# Altium project MB1189.PrjPCB (part 1 of 3)
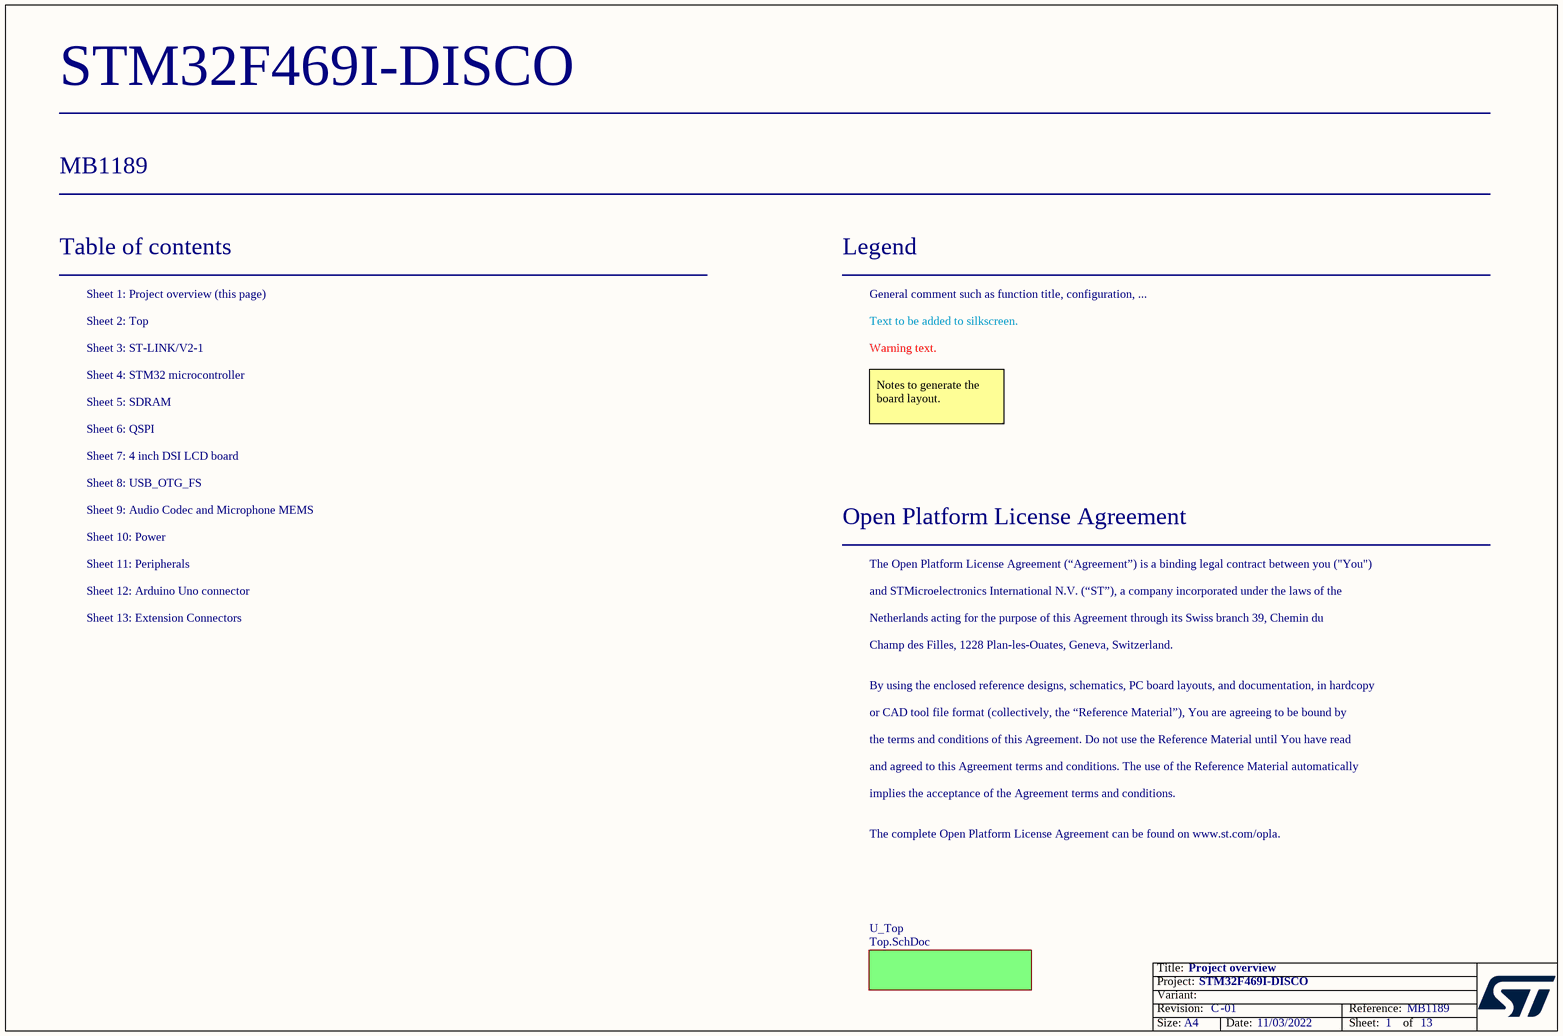
[diagram p0: Project_Overview.SchDoc]
Board_Reference: MB1189; Board_PCB_Revision: C; Board_Name: STM32F469I-DISCO; Board_Document_Date: 11/03/2022; Board_Assembly_revision: 01
13 sheets, 276 parts. Net scope: flat (ports and power ports of the same name join across sheets).
Board file: MB1189.PcbDoc
Sheets:
  Project_Overview.SchDoc
    U_Top = Top.SchDoc
      U_Memory = Memory.SchDoc
      U_Peripherals = Peripherals.SchDoc
      U_Power = Power.SchDoc
      U_ST_LINK_V2-1 = ST_LINK_V2-1.SCHDOC
      U_MCU = MCU.SchDoc
      U_Arduino_ Connectors = Arduino_ Connectors.SchDoc
      U_DSI_LCD = DSI_LCD.SchDoc
      U_QSPI = QSPI.SchDoc
      U_AUDIO2 = AUDIO2.SchDoc
      U_USB_OTG_FS = USB_OTG_FS.SchDoc
      U_ExtensionConnector = ExtensionConnector.SchDoc

## Sheet Project_Overview.SchDoc: Project overview
size A4; Date: Not used; ApprovedBy: Not used; CheckedBy: Not used; Author: Not used; CompanyName: STMicroelectronics; DrawnBy: Not used; Engineer: Not used; Organization: Not used; Address1: Not used; Address2: Not used; Address3: Not used; Address4: Not used; DocumentNumber: MB1189; Revision: Not used; SheetNumber: 1; SheetTotal: 13; CurrentTime: Not used; CurrentDate: Not used; Time: Not used; DocumentFullPathAndName: Not used; DocumentName: Not used; ModifiedDate: Not used; ImagePath: Not used; ProjectName: Not used; Application_BuildNumber: Not used

### Sub-sheets
U_Top = Top.SchDoc: no entries

### Notes on the sheet
- Table of contents
- Sheet 1: Project overview (this page)
- Legend
- General comment such as function title, configuration, ...
- Sheet 2: Top
- Sheet 3: ST-LINK/V2-1
- Sheet 4: STM32 microcontroller
- Text to be added to silkscreen.
- Warning text.
- Sheet 5: SDRAM
- Sheet 6: QSPI
- Notes to generate the board layout.
- Sheet 7: 4 inch DSI LCD board
- Sheet 9: Audio Codec and Microphone MEMS
- Sheet 8: USB_OTG_FS
- Sheet 10: Power
- Sheet 11: Peripherals
- Open Platform License Agreement
- The Open Platform License Agreement (“Agreement”) is a binding legal contract between you ("You")
- Sheet 12: Arduino Uno connector
- Sheet 13: Extension Connectors
- and STMicroelectronics International N.V. (“ST”), a company incorporated under the laws of the
- Netherlands acting for the purpose of this Agreement through its Swiss branch 39, Chemin du
- Champ des Filles, 1228 Plan-les-Ouates, Geneva, Switzerland.
- By using the enclosed reference designs, schematics, PC board layouts, and documentation, in hardcopy
- or CAD tool file format (collectively, the “Reference Material”), You are agreeing to be bound by
- the terms and conditions of this Agreement. Do not use the Reference Material until You have read
- and agreed to this Agreement terms and conditions. The use of the Reference Material automatically
- implies the acceptance of the Agreement terms and conditions.
- The complete Open Platform License Agreement can be found on www.st.com/opla.
- Title:
- Project:
- Size:
- Revision:
- Variant:
- A4
- -
- Date:
- Reference:
- Sheet:
- of

## Sheet Top.SchDoc: MB1189
size A3; Date: 9/24/2014; Author: P.A.; CompanyName: STMicroelectronics; Organization: Microcontrollers Division; Address1: 12, Rue Jules HOROWITZ; Address2: 38019 Grenoble; Address3: FRANCE; DocumentNumber: MB1189; Revision: B-07; SheetNumber: 2; SheetTotal: 13; Project: STM32F469I-DISCO
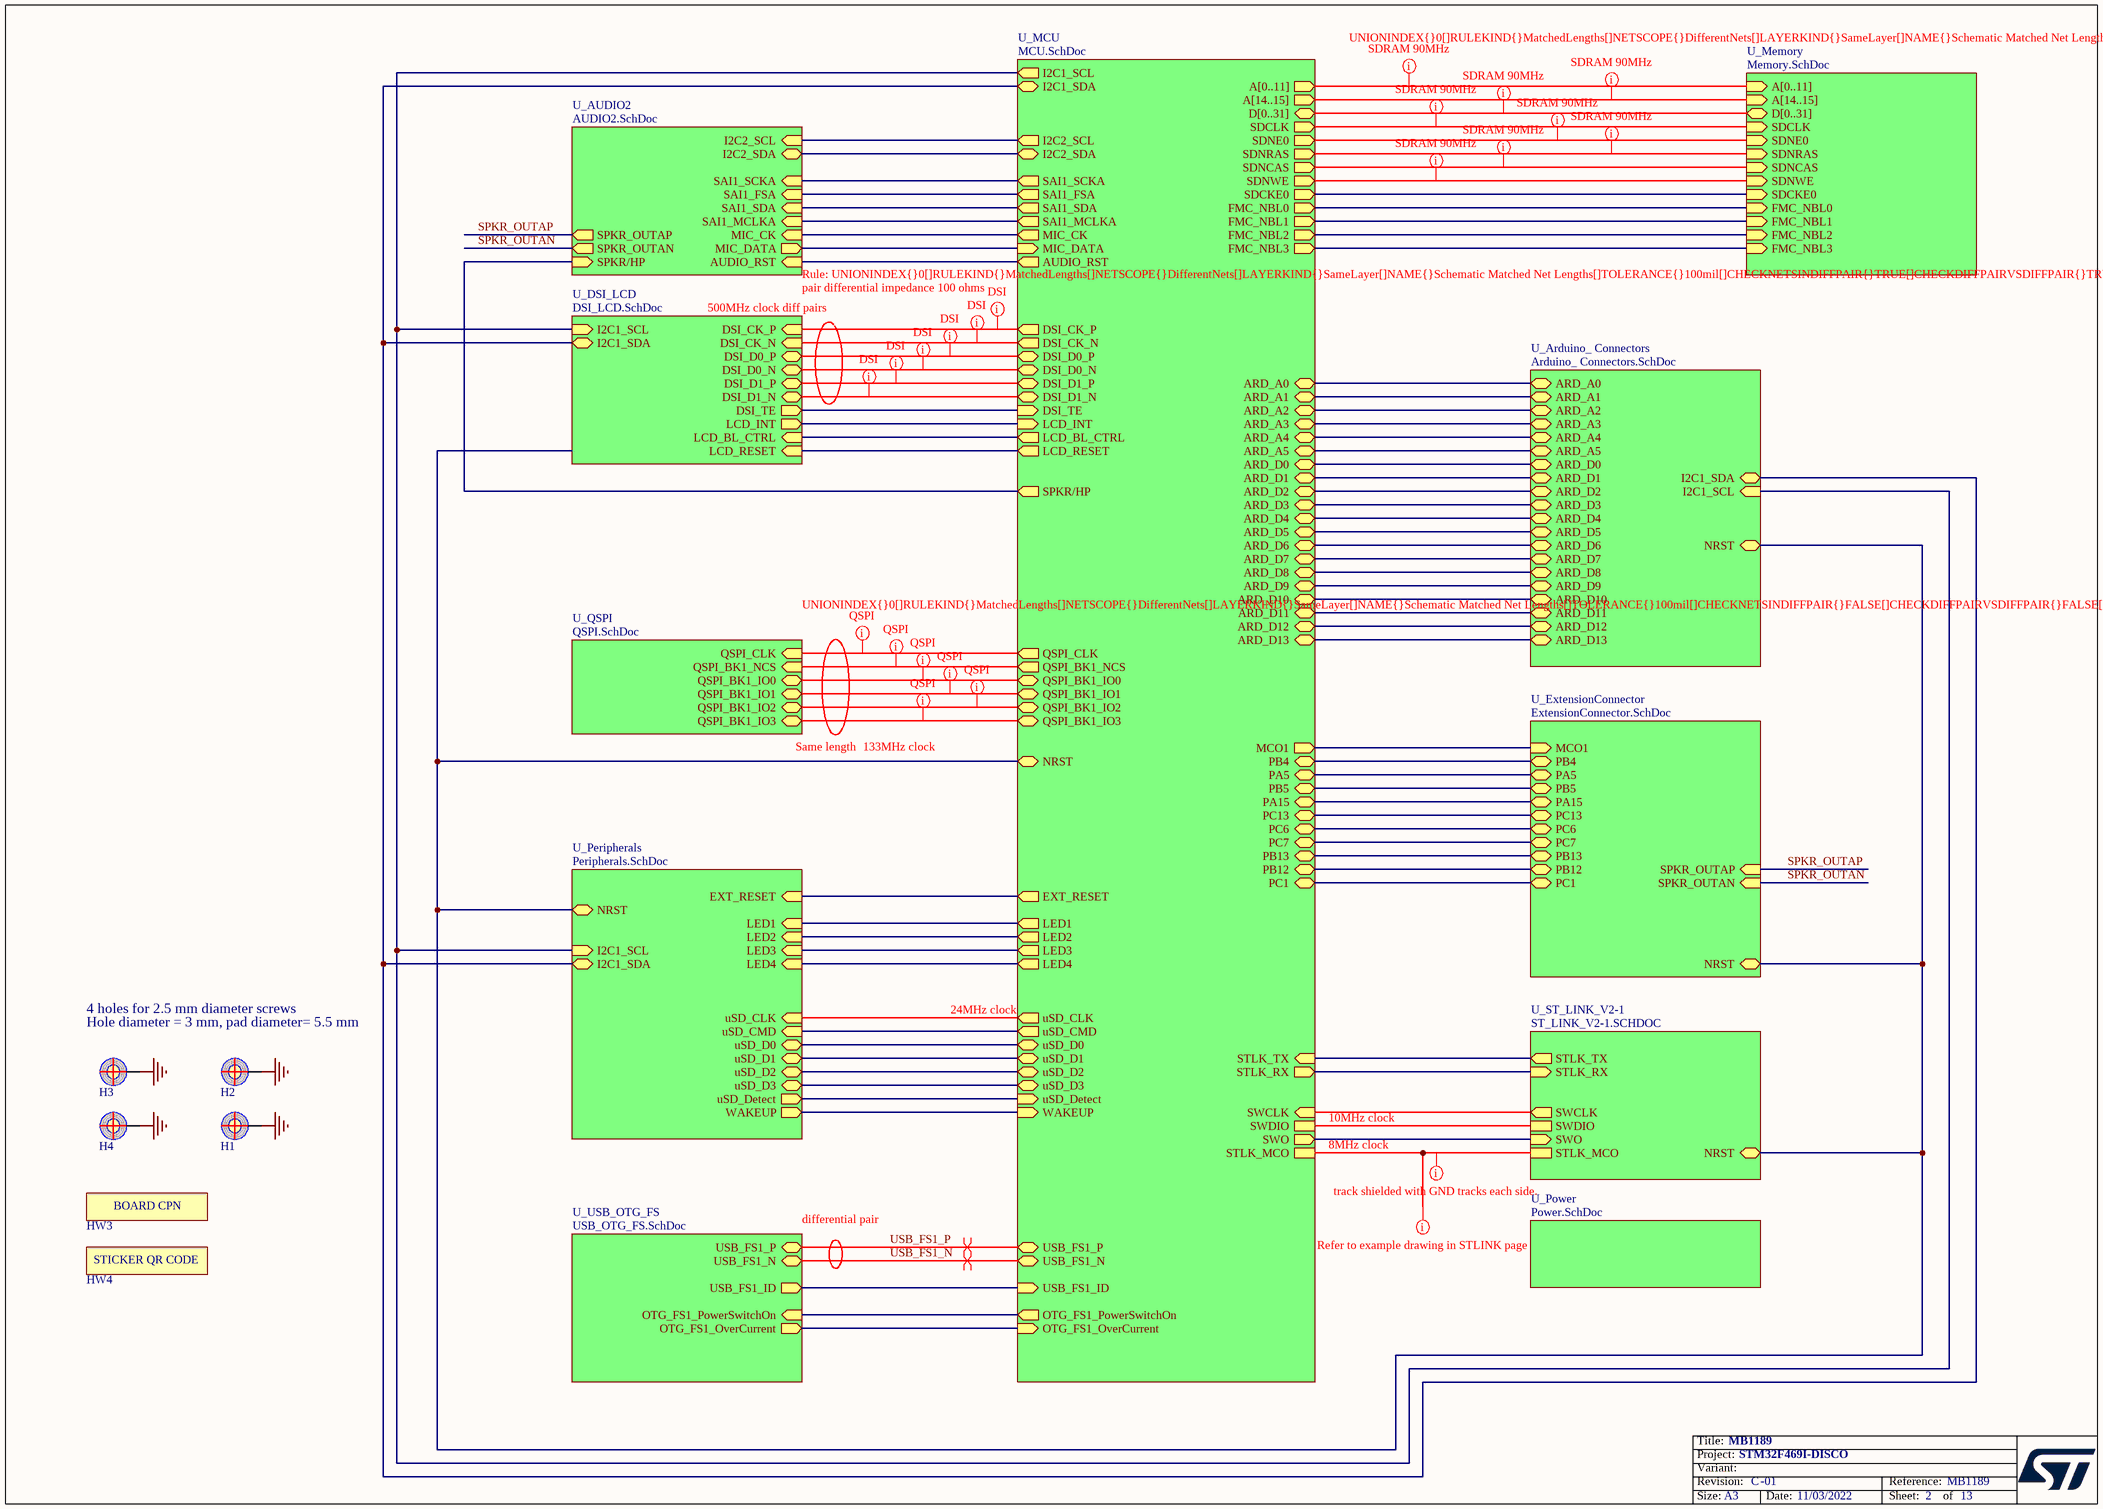
[diagram p1: Top.SchDoc]

### Parts
H1  POSITION HOLE  [HOLE_C5R5D3]  (value not drawn)
H2  POSITION HOLE  [HOLE_C5R5D3]  (value not drawn)
H3  POSITION HOLE  [HOLE_C5R5D3]  (value not drawn)
H4  POSITION HOLE  [HOLE_C5R5D3]  (value not drawn)
HW3  STICKER_BOARD_CPN  [STICKER_BOARD-CPN_13X3]  (value not drawn)  (no BOM)
HW4  STICKER_QR_CODE  [STICKER_QR_CODE_8X8]  (value not drawn)  (no BOM)

### Sub-sheets
U_Arduino_ Connectors = Arduino_ Connectors.SchDoc: I2C1_SDA (bidir), ARD_A0 (bidir), ARD_A1 (bidir), ARD_A2 (bidir), ARD_A3 (bidir), ARD_A4 (bidir), ARD_A5 (bidir), ARD_D5 (bidir), ARD_D4 (bidir), ARD_D3 (bidir), ARD_D2 (bidir), ARD_D1 (bidir), ARD_D0 (bidir), ARD_D13 (bidir), ARD_D12 (bidir), ARD_D11 (bidir), ARD_D10 (bidir), ARD_D9 (bidir), ARD_D8 (bidir), ARD_D6 (bidir), ARD_D7 (bidir), I2C1_SCL (in), NRST (bidir)
U_AUDIO2 = AUDIO2.SchDoc: SAI1_SCKA (in), SAI1_FSA (in), SAI1_SDA (in), AUDIO_RST (in), SAI1_MCLKA (in), I2C2_SCL (in), I2C2_SDA (bidir), MIC_CK (in), MIC_DATA (out), SPKR_OUTAP (out), SPKR_OUTAN (out), SPKR/HP (in)
U_DSI_LCD = DSI_LCD.SchDoc: DSI_CK_P (in), DSI_CK_N (in), DSI_D0_P (bidir), DSI_D0_N (bidir), DSI_D1_P (bidir), DSI_D1_N (bidir), DSI_TE (out), I2C1_SDA (bidir), I2C1_SCL (in), LCD_BL_CTRL (in), LCD_INT (out), LCD_RESET (in)
U_ExtensionConnector = ExtensionConnector.SchDoc: SPKR_OUTAP (in), SPKR_OUTAN (in), NRST (bidir), MCO1 (in), PB4 (bidir), PA5 (bidir), PB5 (bidir), PA15 (bidir), PC13 (bidir), PC7 (bidir), PC6 (bidir), PB13 (bidir), PB12 (bidir), PC1 (bidir)
U_MCU = MCU.SchDoc: LCD_BL_CTRL (out), MIC_CK (out), I2C1_SCL (out), I2C1_SDA (bidir), uSD_D0 (bidir), uSD_D1 (bidir), uSD_D2 (bidir), EXT_RESET (out), uSD_D3 (bidir), uSD_CLK (out), uSD_CMD (out), FMC_NBL3 (out), FMC_NBL2 (out), FMC_NBL0 (out), FMC_NBL1 (out), SAI1_SDA (out), SAI1_SCKA (out), SAI1_FSA (out), SAI1_MCLKA (out), SDNRAS (out), SDCLK (out), SDNCAS (out), SDCKE0 (out), SDNE0 (out), SDNWE (out), D[0..31] (bidir), QSPI_CLK (out), QSPI_BK1_NCS (out), QSPI_BK1_IO3 (bidir), QSPI_BK1_IO2 (bidir), QSPI_BK1_IO1 (bidir), QSPI_BK1_IO0 (bidir), WAKEUP (in), DSI_TE (in), DSI_CK_P (out), DSI_CK_N (out), DSI_D0_P (bidir), DSI_D0_N (bidir), DSI_D1_P (bidir), DSI_D1_N (bidir), NRST (bidir), LCD_INT (in), LED1 (out), LED2 (out), LED3 (out), LED4 (out), uSD_Detect (in), STLK_TX (in), STLK_RX (out), ARD_D5 (bidir), ARD_D4 (bidir), ARD_D3 (bidir), ARD_D2 (bidir), ARD_D1 (bidir), ARD_D0 (bidir), ARD_D13 (bidir), ARD_D12 (bidir), ARD_D11 (bidir), ARD_D10 (bidir), ARD_D9 (bidir), ARD_D8 (bidir), ARD_D6 (bidir), ARD_D7 (bidir), ARD_A0 (bidir), ARD_A1 (bidir), ARD_A2 (bidir), ARD_A3 (bidir), ARD_A4 (bidir), ARD_A5 (bidir), SWCLK (in), SWO (out), AUDIO_RST (out), USB_FS1_ID (in), OTG_FS1_PowerSwitchOn (out), OTG_FS1_OverCurrent (in), I2C2_SCL (out), I2C2_SDA (bidir), MIC_DATA (in), MCO1 (out), USB_FS1_N (bidir), USB_FS1_P (bidir), SWDIO, SPKR/HP (out), A[0..11] (out), A[14..15] (out), PB4 (bidir), PB5 (bidir), PA5 (bidir), PA15 (bidir), PC7 (bidir), PC6 (bidir), PC13 (bidir), PB12 (bidir), PB13 (bidir), PC1 (bidir), LCD_RESET (out), STLK_MCO
U_Memory = Memory.SchDoc: FMC_NBL0 (in), FMC_NBL1 (in), D[0..31] (bidir), SDNCAS (in), SDNWE (in), SDNRAS (in), SDNE0 (in), SDCKE0 (in), SDCLK (in), FMC_NBL3 (in), FMC_NBL2 (in), A[0..11] (in), A[14..15] (in)
U_Peripherals = Peripherals.SchDoc: uSD_CLK (in), uSD_CMD (in), uSD_D0 (bidir), uSD_D1 (bidir), uSD_D2 (bidir), uSD_D3 (bidir), WAKEUP (out), EXT_RESET (in), LED1 (in), LED2 (in), LED3 (in), LED4 (in), NRST (bidir), uSD_Detect (out), I2C1_SDA (bidir), I2C1_SCL (in)
U_Power = Power.SchDoc: no entries
U_QSPI = QSPI.SchDoc: QSPI_BK1_IO0 (bidir), QSPI_BK1_IO2 (bidir), QSPI_BK1_IO1 (bidir), QSPI_CLK (in), QSPI_BK1_NCS (in), QSPI_BK1_IO3 (bidir)
U_ST_LINK_V2-1 = ST_LINK_V2-1.SCHDOC: STLK_RX (in), STLK_TX (out), SWDIO, SWO (in), SWCLK (out), NRST (bidir), STLK_MCO
U_USB_OTG_FS = USB_OTG_FS.SchDoc: OTG_FS1_PowerSwitchOn (in), OTG_FS1_OverCurrent (out), USB_FS1_ID (out), USB_FS1_N (bidir), USB_FS1_P (bidir)

### Nets
GND: H1.1 H2.1 H3.1 H4.1
SPKR_OUTAN: sheet U_AUDIO2/SPKR_OUTAN, sheet U_ExtensionConnector/SPKR_OUTAN
SPKR_OUTAP: sheet U_AUDIO2/SPKR_OUTAP, sheet U_ExtensionConnector/SPKR_OUTAP
USB_FS1_N: sheet U_MCU/USB_FS1_N, sheet U_USB_OTG_FS/USB_FS1_N
USB_FS1_P: sheet U_MCU/USB_FS1_P, sheet U_USB_OTG_FS/USB_FS1_P
(unnamed): sheet U_Memory/FMC_NBL0, sheet U_MCU/FMC_NBL0
(unnamed): sheet U_Memory/FMC_NBL1, sheet U_MCU/FMC_NBL1
(unnamed): sheet U_Memory/SDNCAS, sheet U_MCU/SDNCAS
(unnamed): sheet U_Memory/SDNWE, sheet U_MCU/SDNWE
(unnamed): sheet U_Memory/SDNRAS, sheet U_MCU/SDNRAS
(unnamed): sheet U_Memory/SDNE0, sheet U_MCU/SDNE0
(unnamed): sheet U_Memory/SDCKE0, sheet U_MCU/SDCKE0
(unnamed): sheet U_Memory/SDCLK, sheet U_MCU/SDCLK
(unnamed): sheet U_Memory/FMC_NBL3, sheet U_MCU/FMC_NBL3
(unnamed): sheet U_Memory/FMC_NBL2, sheet U_MCU/FMC_NBL2
(unnamed): sheet U_Peripherals/uSD_CLK, sheet U_MCU/uSD_CLK
(unnamed): sheet U_Peripherals/uSD_CMD, sheet U_MCU/uSD_CMD
(unnamed): sheet U_Peripherals/uSD_D0, sheet U_MCU/uSD_D0
(unnamed): sheet U_Peripherals/uSD_D1, sheet U_MCU/uSD_D1
(unnamed): sheet U_Peripherals/uSD_D2, sheet U_MCU/uSD_D2
(unnamed): sheet U_Peripherals/uSD_D3, sheet U_MCU/uSD_D3
(unnamed): sheet U_Peripherals/WAKEUP, sheet U_MCU/WAKEUP
(unnamed): sheet U_Peripherals/EXT_RESET, sheet U_MCU/EXT_RESET
(unnamed): sheet U_Peripherals/LED1, sheet U_MCU/LED1
(unnamed): sheet U_Peripherals/LED2, sheet U_MCU/LED2
(unnamed): sheet U_Peripherals/LED3, sheet U_MCU/LED3
(unnamed): sheet U_Peripherals/LED4, sheet U_MCU/LED4
(unnamed): sheet U_Peripherals/NRST, sheet U_ST_LINK_V2-1/NRST, sheet U_MCU/NRST, sheet U_Arduino_ Connectors/NRST, sheet U_ExtensionConnector/NRST
(unnamed): sheet U_Peripherals/uSD_Detect, sheet U_MCU/uSD_Detect
(unnamed): sheet U_Peripherals/I2C1_SDA, sheet U_MCU/I2C1_SDA, sheet U_Arduino_ Connectors/I2C1_SDA, sheet U_DSI_LCD/I2C1_SDA
(unnamed): sheet U_Peripherals/I2C1_SCL, sheet U_MCU/I2C1_SCL, sheet U_Arduino_ Connectors/I2C1_SCL, sheet U_DSI_LCD/I2C1_SCL
(unnamed): sheet U_ST_LINK_V2-1/STLK_RX, sheet U_MCU/STLK_RX
(unnamed): sheet U_ST_LINK_V2-1/STLK_TX, sheet U_MCU/STLK_TX
(unnamed): sheet U_ST_LINK_V2-1/SWDIO, sheet U_MCU/SWDIO
(unnamed): sheet U_ST_LINK_V2-1/SWO, sheet U_MCU/SWO
(unnamed): sheet U_ST_LINK_V2-1/SWCLK, sheet U_MCU/SWCLK
(unnamed): sheet U_ST_LINK_V2-1/STLK_MCO, sheet U_MCU/STLK_MCO
(unnamed): sheet U_MCU/LCD_BL_CTRL, sheet U_DSI_LCD/LCD_BL_CTRL
(unnamed): sheet U_MCU/MIC_CK, sheet U_AUDIO2/MIC_CK
(unnamed): sheet U_MCU/SAI1_SDA, sheet U_AUDIO2/SAI1_SDA
(unnamed): sheet U_MCU/SAI1_SCKA, sheet U_AUDIO2/SAI1_SCKA
(unnamed): sheet U_MCU/SAI1_FSA, sheet U_AUDIO2/SAI1_FSA
(unnamed): sheet U_MCU/SAI1_MCLKA, sheet U_AUDIO2/SAI1_MCLKA
(unnamed): sheet U_MCU/QSPI_CLK, sheet U_QSPI/QSPI_CLK
(unnamed): sheet U_MCU/QSPI_BK1_NCS, sheet U_QSPI/QSPI_BK1_NCS
(unnamed): sheet U_MCU/QSPI_BK1_IO3, sheet U_QSPI/QSPI_BK1_IO3
(unnamed): sheet U_MCU/QSPI_BK1_IO2, sheet U_QSPI/QSPI_BK1_IO2
(unnamed): sheet U_MCU/QSPI_BK1_IO1, sheet U_QSPI/QSPI_BK1_IO1
(unnamed): sheet U_MCU/QSPI_BK1_IO0, sheet U_QSPI/QSPI_BK1_IO0
(unnamed): sheet U_MCU/DSI_TE, sheet U_DSI_LCD/DSI_TE
(unnamed): sheet U_MCU/DSI_CK_P, sheet U_DSI_LCD/DSI_CK_P
(unnamed): sheet U_MCU/DSI_CK_N, sheet U_DSI_LCD/DSI_CK_N
(unnamed): sheet U_MCU/DSI_D0_P, sheet U_DSI_LCD/DSI_D0_P
(unnamed): sheet U_MCU/DSI_D0_N, sheet U_DSI_LCD/DSI_D0_N
(unnamed): sheet U_MCU/DSI_D1_P, sheet U_DSI_LCD/DSI_D1_P
(unnamed): sheet U_MCU/DSI_D1_N, sheet U_DSI_LCD/DSI_D1_N
(unnamed): sheet U_MCU/LCD_INT, sheet U_DSI_LCD/LCD_INT
(unnamed): sheet U_MCU/ARD_D5, sheet U_Arduino_ Connectors/ARD_D5
(unnamed): sheet U_MCU/ARD_D4, sheet U_Arduino_ Connectors/ARD_D4
(unnamed): sheet U_MCU/ARD_D3, sheet U_Arduino_ Connectors/ARD_D3
(unnamed): sheet U_MCU/ARD_D2, sheet U_Arduino_ Connectors/ARD_D2
(unnamed): sheet U_MCU/ARD_D1, sheet U_Arduino_ Connectors/ARD_D1
(unnamed): sheet U_MCU/ARD_D0, sheet U_Arduino_ Connectors/ARD_D0
(unnamed): sheet U_MCU/ARD_D13, sheet U_Arduino_ Connectors/ARD_D13
(unnamed): sheet U_MCU/ARD_D12, sheet U_Arduino_ Connectors/ARD_D12
(unnamed): sheet U_MCU/ARD_D11, sheet U_Arduino_ Connectors/ARD_D11
(unnamed): sheet U_MCU/ARD_D10, sheet U_Arduino_ Connectors/ARD_D10
(unnamed): sheet U_MCU/ARD_D9, sheet U_Arduino_ Connectors/ARD_D9
(unnamed): sheet U_MCU/ARD_D8, sheet U_Arduino_ Connectors/ARD_D8
(unnamed): sheet U_MCU/ARD_D6, sheet U_Arduino_ Connectors/ARD_D6
(unnamed): sheet U_MCU/ARD_D7, sheet U_Arduino_ Connectors/ARD_D7
(unnamed): sheet U_MCU/ARD_A0, sheet U_Arduino_ Connectors/ARD_A0
(unnamed): sheet U_MCU/ARD_A1, sheet U_Arduino_ Connectors/ARD_A1
(unnamed): sheet U_MCU/ARD_A2, sheet U_Arduino_ Connectors/ARD_A2
(unnamed): sheet U_MCU/ARD_A3, sheet U_Arduino_ Connectors/ARD_A3
(unnamed): sheet U_MCU/ARD_A4, sheet U_Arduino_ Connectors/ARD_A4
(unnamed): sheet U_MCU/ARD_A5, sheet U_Arduino_ Connectors/ARD_A5
(unnamed): sheet U_MCU/AUDIO_RST, sheet U_AUDIO2/AUDIO_RST
(unnamed): sheet U_MCU/USB_FS1_ID, sheet U_USB_OTG_FS/USB_FS1_ID
(unnamed): sheet U_MCU/OTG_FS1_PowerSwitchOn, sheet U_USB_OTG_FS/OTG_FS1_PowerSwitchOn
(unnamed): sheet U_MCU/OTG_FS1_OverCurrent, sheet U_USB_OTG_FS/OTG_FS1_OverCurrent
(unnamed): sheet U_MCU/I2C2_SCL, sheet U_AUDIO2/I2C2_SCL
(unnamed): sheet U_MCU/I2C2_SDA, sheet U_AUDIO2/I2C2_SDA
(unnamed): sheet U_MCU/MIC_DATA, sheet U_AUDIO2/MIC_DATA
(unnamed): sheet U_MCU/MCO1, sheet U_ExtensionConnector/MCO1
(unnamed): sheet U_MCU/SPKR/HP, sheet U_AUDIO2/SPKR/HP
(unnamed): sheet U_MCU/PB4, sheet U_ExtensionConnector/PB4
(unnamed): sheet U_MCU/PB5, sheet U_ExtensionConnector/PB5
(unnamed): sheet U_MCU/PA5, sheet U_ExtensionConnector/PA5
(unnamed): sheet U_MCU/PA15, sheet U_ExtensionConnector/PA15
(unnamed): sheet U_MCU/PC7, sheet U_ExtensionConnector/PC7
(unnamed): sheet U_MCU/PC6, sheet U_ExtensionConnector/PC6
(unnamed): sheet U_MCU/PC13, sheet U_ExtensionConnector/PC13
(unnamed): sheet U_MCU/PB12, sheet U_ExtensionConnector/PB12
(unnamed): sheet U_MCU/PB13, sheet U_ExtensionConnector/PB13
(unnamed): sheet U_MCU/PC1, sheet U_ExtensionConnector/PC1
(unnamed): sheet U_MCU/LCD_RESET, sheet U_DSI_LCD/LCD_RESET

### Buses and harness runs
bus sheet U_MCU/A[0..11] = sheet U_Memory/A[0..11]
bus sheet U_MCU/A[14..15] = sheet U_Memory/A[14..15]
bus sheet U_MCU/D[0..31] = sheet U_Memory/D[0..31]

### Layout directives
rule Matched Net Lengths [Tolerance = 250mil]: (no net found under the mark)
rule Matched Net Lengths [Tolerance = 100mil]; rule ? : (no net found under the mark)
rule Matched Net Lengths [Tolerance = 100mil]: (no net found under the mark)
differential pair: USB_FS1_N, USB_FS1_P
mark named track shielded with GND tracks each side.: (no net found under the mark)
mark named Refer to example drawing in STLINK page: (no net found under the mark)

### Notes on the sheet
- 500MHz clock diff pairs
- Same length
- 133MHz clock
- 4 holes for 2.5 mm diameter screws
- Hole diameter = 3 mm, pad diameter= 5.5 mm
- 24MHz clock
- 10MHz clock
- 8MHz clock
- differential pair
- Title:
- Project:
- Size:
- Revision:
- Variant:
- A3
- -
- Date:
- Reference:
- Sheet:
- of
- (in symbol STICKER_BOARD_CPN) BOARD CPN
- (in symbol STICKER_QR_CODE) STICKER QR CODE

### Library data of the parts
H1-H4 = POSITION HOLE: Ordered by: Subcon

## Sheet Memory.SchDoc: SDRAM
size A4; Date: 9/24/2014; Author: P.A.; CompanyName: STMicroelectronics; Organization: Microcontrollers Division; Address1: 12, Rue Jules HOROWITZ; Address2: 38019 Grenoble; Address3: FRANCE; DocumentNumber: MB1189; Revision: B-07; SheetNumber: 5; SheetTotal: 13; Project: STM32F469I-DISCO
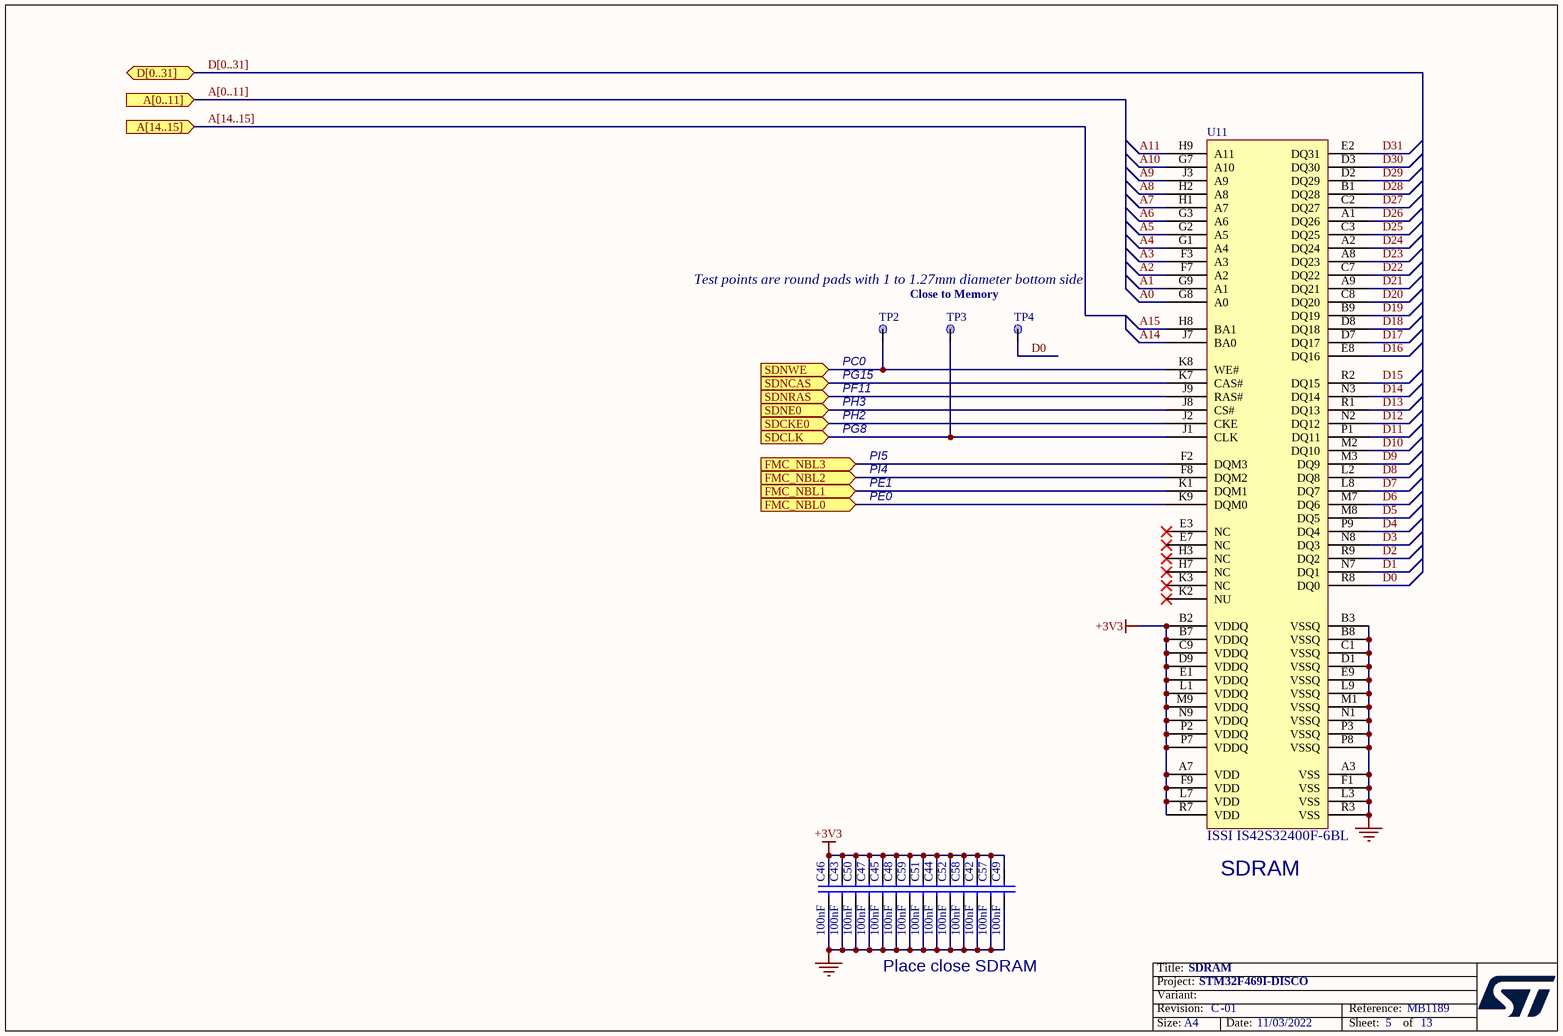
[diagram p2: Memory.SchDoc]

### Parts
C42  100nF  [0402C]
C43  100nF  [0402C]
C44  100nF  [0402C]
C45  100nF  [0402C]
C46  100nF  [0402C]
C47  100nF  [0402C]
C48  100nF  [0402C]
C49  100nF  [0402C]
C50  100nF  [0402C]
C51  100nF  [0402C]
C52  100nF  [0402C]
C57  100nF  [0402C]
C58  100nF  [0402C]
C59  100nF  [0402C]
TP2  TP  [TP_C40]  (value not drawn)
TP3  TP  [TP_C40]  (value not drawn)
TP4  TP  [TP_C40]  (value not drawn)
U11  ISSI IS42S32400F-6BL  [ICC_VFBGA90_8X13_P080]

### Ports
A[0..11] (in), A[14..15] (in), D[0..31] (bidir), FMC_NBL0 (in), FMC_NBL1 (in), FMC_NBL2 (in), FMC_NBL3 (in), SDCKE0 (in), SDCLK (in), SDNCAS (in), SDNE0 (in), SDNRAS (in), SDNWE (in)

### Nets
+3V3: C42.1 C43.1 C44.1 C45.1 C46.1 C47.1 C48.1 C49.1 C50.1 C51.1 C52.1 C57.1 C58.1 C59.1 U11.A7(VDD) U11.B2(VDDQ) U11.B7(VDDQ) U11.C9(VDDQ) U11.D9(VDDQ) U11.E1(VDDQ) U11.F9(VDD) U11.L1(VDDQ) U11.L7(VDD) U11.M9(VDDQ) U11.N9(VDDQ) U11.P2(VDDQ) U11.P7(VDDQ) U11.R7(VDD)
GND: C42.2 C43.2 C44.2 C45.2 C46.2 C47.2 C48.2 C49.2 C50.2 C51.2 C52.2 C57.2 C58.2 C59.2 U11.A3(VSS) U11.B3(VSSQ) U11.B8(VSSQ) U11.C1(VSSQ) U11.D1(VSSQ) U11.E9(VSSQ) U11.F1(VSS) U11.L3(VSS) U11.L9(VSSQ) U11.M1(VSSQ) U11.N1(VSSQ) U11.P3(VSSQ) U11.P8(VSSQ) U11.R3(VSS)
A0: U11.G8(A0)
A1: U11.G9(A1)
A2: U11.F7(A2)
A3: U11.F3(A3)
A4: U11.G1(A4)
A5: U11.G2(A5)
A6: U11.G3(A6)
A7: U11.H1(A7)
A8: U11.H2(A8)
A9: U11.J3(A9)
A10: U11.G7(A10)
A11: U11.H9(A11)
A14: U11.J7(BA0)
A15: U11.H8(BA1)
D0: TP4.1 U11.R8(DQ0)
D1: U11.N7(DQ1)
D2: U11.R9(DQ2)
D3: U11.N8(DQ3)
D4: U11.P9(DQ4)
D5: U11.M8(DQ5)
D6: U11.M7(DQ6)
D7: U11.L8(DQ7)
D8: U11.L2(DQ8)
D9: U11.M3(DQ9)
D10: U11.M2(DQ10)
D11: U11.P1(DQ11)
D12: U11.N2(DQ12)
D13: U11.R1(DQ13)
D14: U11.N3(DQ14)
D15: U11.R2(DQ15)
D16: U11.E8(DQ16)
D17: U11.D7(DQ17)
D18: U11.D8(DQ18)
D19: U11.B9(DQ19)
D20: U11.C8(DQ20)
D21: U11.A9(DQ21)
D22: U11.C7(DQ22)
D23: U11.A8(DQ23)
D24: U11.A2(DQ24)
D25: U11.C3(DQ25)
D26: U11.A1(DQ26)
D27: U11.C2(DQ27)
D28: U11.B1(DQ28)
D29: U11.D2(DQ29)
D30: U11.D3(DQ30)
D31: U11.E2(DQ31)
PC0: TP2.1 U11.K8(WE#) ; port SDNWE
PE0: U11.K9(DQM0) ; port FMC_NBL0
PE1: U11.K1(DQM1) ; port FMC_NBL1
PF11: U11.J9(RAS#) ; port SDNRAS
PG8: TP3.1 U11.J1(CLK) ; port SDCLK
PG15: U11.K7(CAS#) ; port SDNCAS
PH2: U11.J2(CKE) ; port SDCKE0
PH3: U11.J8(CS#) ; port SDNE0
PI4: U11.F8(DQM2) ; port FMC_NBL2
PI5: U11.F2(DQM3) ; port FMC_NBL3

Not connected (* = marked no-connect by the designer): U11 E3(NC)* E7(NC)* H3(NC)* H7(NC)* K2(NU)* K3(NC)*

### Buses and harness runs
bus A[0..11] = port A[0..11]
bus A[14..15] = port A[14..15]
bus D[0..31] = port D[0..31]

### Notes on the sheet
- Test points are round pads with 1 to 1.27mm diameter bottom side
- Close to Memory
- (near TP2) PC0
- (near TP2) PG15
- PF11
- PH3
- PH2
- PG8
- PE1
- PE0
- PI5
- PI4
- (near U11) SDRAM
- Place close SDRAM
- Title:
- Project:
- Size:
- Revision:
- Variant:
- A4
- -
- Date:
- Reference:
- Sheet:
- of

### Library data of the parts
C42-C52 C57-C59 = Cap: Capacitor; Manuf_part_1: CC0402KRX7R7BB104; Manuf_1: YAGEO; Ordered by: Subcon; Published: 8-Jun-2000; Revision: July-2002: Re-released for DXP Platform.; Publisher: Altium Limited; Value: 100nF
TP2-TP4 = TP: Ordered by: Subcon
U11 = IS42S32400F-6BL: SDRAM 128MBit 166MHZ 90BGA; Ordered by: Subcon; ECCN_US/EU: EAR99/NEC; Manuf_1: ISSI; Manuf_Part_1: IS42S32400F-6BL; Value: IS42S32400F-6BL

## Sheet Peripherals.SchDoc: Peripherals
size A4; Date: 9/24/2014; Author: P.A.; CompanyName: STMicroelectronics; Organization: Microcontrollers Division; Address1: 12, Rue Jules HOROWITZ; Address2: 38019 Grenoble; Address3: FRANCE; DocumentNumber: MB1189; Revision: B-07; SheetNumber: 11; SheetTotal: 13; Project: STM32F469I-DISCO
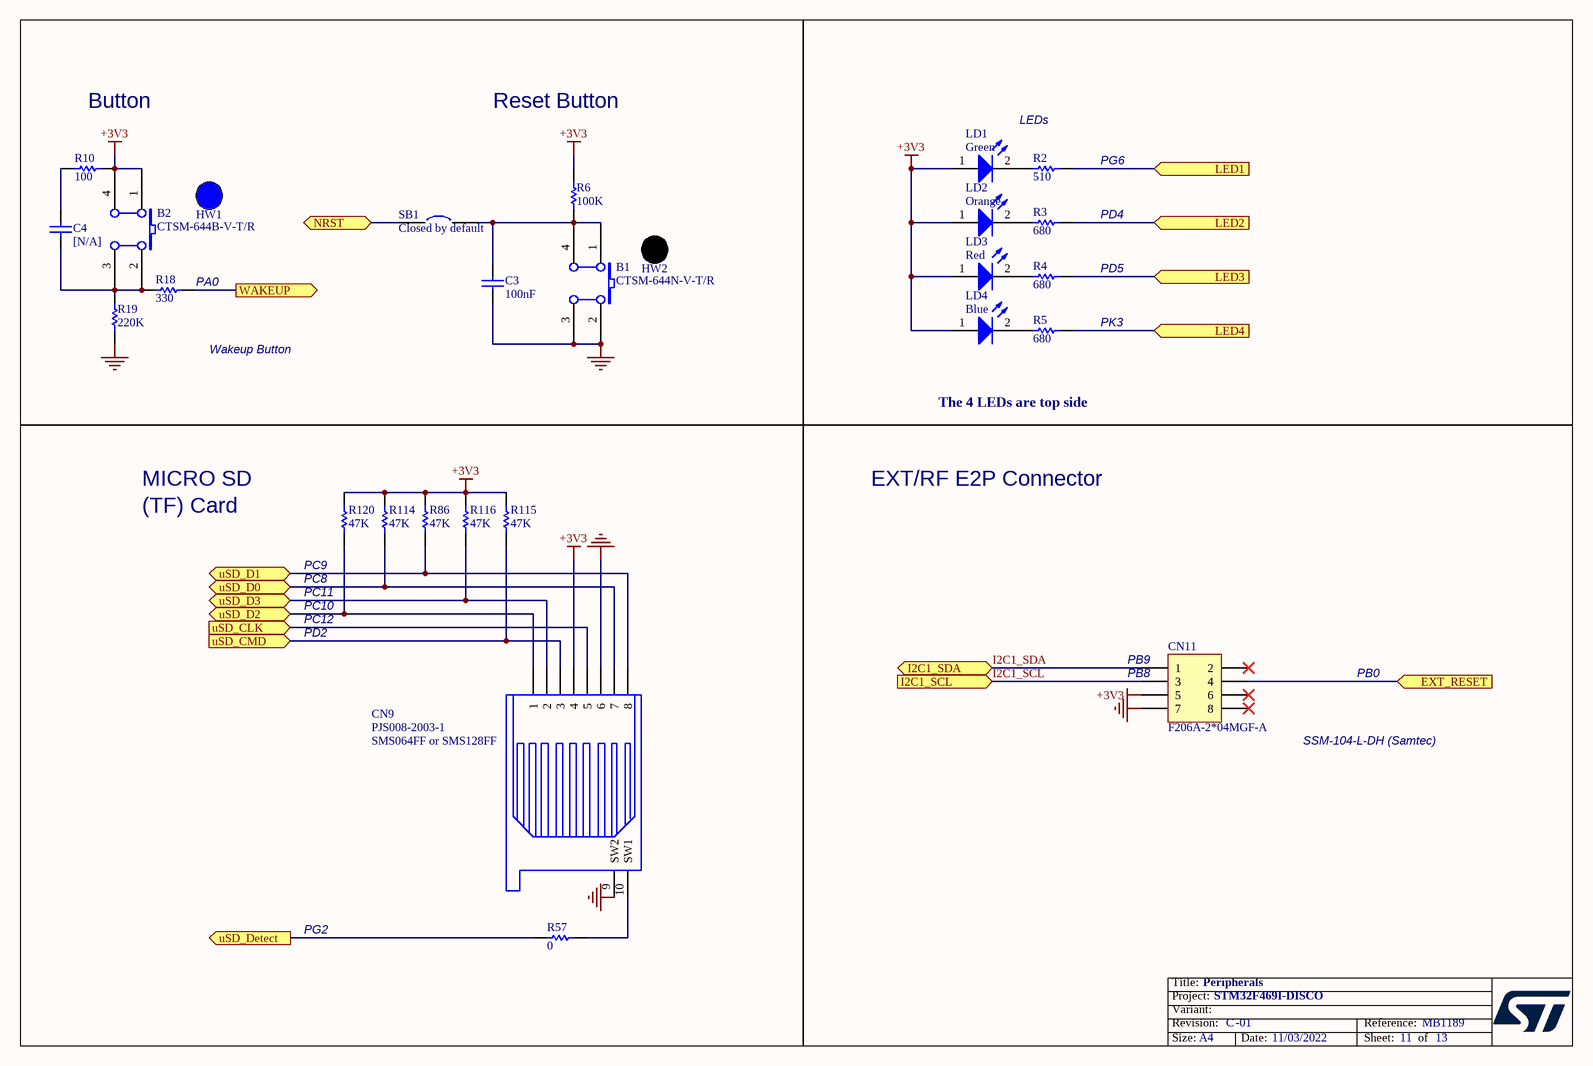
[diagram p3: Peripherals.SchDoc]

### Parts
B1  CTSM-644N-V-T/R  [PB10]
B2  CTSM-644B-V-T/R  [PB10]
C3  100nF  [0402C]
C4  [N/A]  [0603C]
CN9  PJS008-2003-1  [MSD_PJS008_]
CN11  F206A-2*04MGF-A  [SSM-104-L-DH]
HW1  BUTTON_HAT_BLUE  (value not drawn)  (mechanical)
HW2  BUTTON_HAT_BLACK  (value not drawn)  (mechanical)
LD1  Green  [0603D]
LD2  Orange  [0603D]
LD3  Red  [0603D]
LD4  Blue  [0603D]
R2  510  [0603R]
R3  680  [0603R]
R4  680  [0603R]
R5  680  [0603R]
R6  100K  [0603R]
R10  100  [0603R]
R18  330  [0603R]
R19  220K  [0603R]
R57  0  [0603R]
R86  47K  [0603R]
R114  47K  [0603R]
R115  47K  [0603R]
R116  47K  [0603R]
R120  47K  [0603R]
SB1  Closed by default  [SB_0603]

### Ports
EXT_RESET (in), I2C1_SCL (in), I2C1_SDA (bidir), LED1 (in), LED2 (in), LED3 (in), LED4 (in), NRST (bidir), uSD_CLK (in), uSD_CMD (in), uSD_D0 (bidir), uSD_D1 (bidir), uSD_D2 (bidir), uSD_D3 (bidir), uSD_Detect (out), WAKEUP (out)

### Nets
+3V3: B2.1(A0) B2.4(A1) CN9.4 CN11.5 LD1.1(A) LD2.1(A) LD3.1(A) LD4.1(A) R6.1 R10.1 R86.1 R114.1 R115.1 R116.1 R120.1
GND: B1.2(B0) B1.3(B1) C3.1 CN9.6 CN9.9(SW2) CN11.7 R19.2
I2C1_SCL: CN11.3 ; port I2C1_SCL
I2C1_SDA: CN11.1 ; port I2C1_SDA
NRST: SB1.1 ; port NRST
PA0: R18.2 ; port WAKEUP
PB0: CN11.4 ; port EXT_RESET
PC8: CN9.7 R114.2 ; port uSD_D0
PC10: CN9.1 R120.2 ; port uSD_D2
PC11: CN9.2 R116.2 ; port uSD_D3
PC12: CN9.5 ; port uSD_CLK
PD2: CN9.3 R115.2 ; port uSD_CMD
PD4: R3.1 ; port LED2
PD5: R4.1 ; port LED3
PG2: R57.1 ; port uSD_Detect
PG6: R2.1 ; port LED1
PK3: R5.1 ; port LED4
uSD_D1: CN9.8 R86.2 ; port uSD_D1
NetB1_1: B1.1(A0) B1.4(A1) C3.2 R6.2 SB1.2
NetB2_2: B2.2(B0) B2.3(B1) C4.2 R18.1 R19.1
NetC4_1: C4.1 R10.2
NetCN9_10: CN9.10(SW1) R57.2
NetLD1_2: LD1.2(K) R2.2
NetLD2_2: LD2.2(K) R3.2
NetLD3_2: LD3.2(K) R4.2
NetLD4_2: LD4.2(K) R5.2

Not connected (* = marked no-connect by the designer): CN11 2* 6* 8*

### Notes on the sheet
- Button
- Reset Button
- LEDs
- (near R2) PG6
- PD4
- (near R18) PA0
- PD5
- PK3
- Wakeup Button
- The 4 LEDs are top side
- MICRO SD
- (TF) Card
- EXT/RF E2P Connector
- (near R120) PC8
- (near R120) PC9
- PC11
- PC10
- PC12
- PD2
- (near CN11) PB9
- (near CN11) PB8
- PB0
- (near CN9) SMS064FF or SMS128FF
- (near CN11) SSM-104-L-DH (Samtec)
- PG2
- Title:
- Project:
- Size:
- Revision:
- Variant:
- A4
- -
- Date:
- Reference:
- Sheet:
- of

### Library data of the parts
B1 = SW PUSHBUTTON: Push-Button BLACK; Manuf_1: CHAU HUA; Ordered by: Subcon; Assembly: with Blue cap; Silkscreen: USER; Manuf_part_1: CTSM-644N-V-T/R; Value: CTSM-644N-V-T/R
B2 = SW PUSHBUTTON: Push-Button BLUE; Manuf_1: CHAU HUA; Ordered by: Subcon; Assembly: with Blue cap; Silkscreen: USER; Manuf_part_1: CTSM-644B-V-T/R; Value: CTSM-644B-V-T/R
C3 = CAP: Capacitor; Manuf_part_1: CC0402KRX7R7BB104; Manuf_1: YAGEO; Ordered by: Subcon; Published: 8-Jun-2000; Revision: July-2002: Re-released for DXP Platform.; Publisher: Altium Limited; Value: 100NF
C4 = CAP: Capacitor; Value: 100pF; Ordered by: Subcon; Fitted: NO; Published: 8-Jun-2000; Revision: July-2002: Re-released for DXP Platform.; Publisher: Altium Limited
CN9 = SMS016AFA5E: MicroSD Card Conn, Reversed-Type, Mnt Push-Push, Positionning holes; Manuf_1: Yamaichi; Ordered by: Subcon; Silkscreen: uSD; Manuf_Part_1: PJS008-2003-1
CN11 = SSM-104-L-DH: Header, 4-Pin, Dual row; Manuf_1: SAMTEC; Ordered by: Subcon; Silkscreen: RFEEPROM; Revision: 17-Jul-2002: Re-released for DXP Platform.; Publisher: Altium Limited; Manuf_Part_1: SSM-104-L-DH
HW1 = BUTTON_HAT_BLUE: switch hat,blue; Manuf_part_1: KTSC-62B; Manuf_1: CHAU HUA
HW2 = BUTTON_HAT_BLACK: switch hat,black; Manuf_part_1: KTSC-62K; Manuf_1: CHAU HUA
LD1 = LED2: Typical RED, GREEN, YELLOW, AMBER GaAs LED; Manuf_1: Everlight Electronics; Manuf_part_1: 19-217/G7C-AN1P2/3T; Ordered by: Subcon; ECCN_US/EU: EAR99/NEC; Published: 8-Jun-2000; Revision: July-2002: Re-released for DXP Platform.; Publisher: Altium Limited
LD2 = LED2: Typical RED, GREEN, YELLOW, AMBER GaAs LED; Manuf_1: Everlight Electronics; Manuf_part_1: 19-217/S2C-AM2N2VY/3T; Ordered by: Subcon; ECCN_US/EU: EAR99/NEC; Published: 8-Jun-2000; Revision: July-2002: Re-released for DXP Platform.; Publisher: Altium Limited
LD3 = LED2: Typical RED, GREEN, YELLOW, AMBER GaAs LED; Manuf_1: Everlight Electronics; Manuf_part_1: 19-217/R6C-AL1M2VY/3T; Ordered by: Subcon; ECCN_US/EU: EAR99/NEC; Published: 8-Jun-2000; Revision: July-2002: Re-released for DXP Platform.; Publisher: Altium Limited
LD4 = LED2: Typical RED, GREEN, YELLOW, AMBER GaAs LED; Manuf_1: Everlight Electronics; Manuf_part_1: 19-217/BHC-ZL1M2RY/3T; Ordered by: Subcon; ECCN_US/EU: EAR99/NEC; Published: 8-Jun-2000; Revision: July-2002: Re-released for DXP Platform.; Publisher: Altium Limited
R2 = Res1: Resistor; Manuf_1: YAGEO; Manuf_part_1: RC0603FR-07510RL; Ordered by: Subcon; Published: 8-Jun-2000; Revision: July-2002: Re-released for DXP Platform.; Publisher: Altium Limited; Value: 510
R3-R5 = Res1: Resistor; Manuf_1: YAGEO; Manuf_part_1: RC0603FR-07680RL; Ordered by: Subcon; Published: 8-Jun-2000; Revision: July-2002: Re-released for DXP Platform.; Publisher: Altium Limited; Value: 680
R6 = res1: Resistor; Manuf_1: YAGEO; Manuf_part_1: RC0603FR-07100KL; Ordered by: Subcon; Published: 8-Jun-2000; Revision: July-2002: Re-released for DXP Platform.; Publisher: Altium Limited; Value: 100K
R10 = Res1: Resistor; Manuf_1: YAGEO; Manuf_part_1: RC0603FR-07100RL; Ordered by: Subcon; Published: 8-Jun-2000; Revision: July-2002: Re-released for DXP Platform.; Publisher: Altium Limited; Value: 100
R18 = Res1: Resistor; Manuf_1: YAGEO; Manuf_part_1: RC0603FR-07330RL; Ordered by: Subcon; Published: 8-Jun-2000; Revision: July-2002: Re-released for DXP Platform.; Publisher: Altium Limited; Value: 330
R19 = res1: Resistor; Manuf_1: YAGEO; Manuf_part_1: RC0603FR-07220KL; Ordered by: Subcon; Published: 8-Jun-2000; Revision: July-2002: Re-released for DXP Platform.; Publisher: Altium Limited; Value: 220k
R57 = Res1: Resistor; Manuf_1: YAGEO; Manuf_part_1: RC0603JR-070RL; Ordered by: Subcon; Published: 8-Jun-2000; Revision: July-2002: Re-released for DXP Platform.; Publisher: Altium Limited; Value: 0
R86 R114-R116 R120 = res1: Resistor; Manuf_1: YAGEO; Manuf_part_1: RC0603FR-0747KL; Ordered by: Subcon; Published: 8-Jun-2000; Revision: July-2002: Re-released for DXP Platform.; Publisher: Altium Limited; Value: 47K
SB1 = Circuit Breaker: Ordered by: Subcon; Comments: Solder bridge; Published: 24-Mar-1999; Revision: July-2002: Re-released for DXP Platform.; Publisher: Altium Limited

## Sheet Power.SchDoc: Power
size A4; Date: 9/24/2014; Author: P.A.; CompanyName: STMicroelectronics; Organization: Microcontrollers Division; Address1: 12, Rue Jules HOROWITZ; Address2: 38019 Grenoble; Address3: FRANCE; DocumentNumber: MB1189; Revision: B-07; SheetNumber: 10; SheetTotal: 13; Project: STM32F469I-DISCO
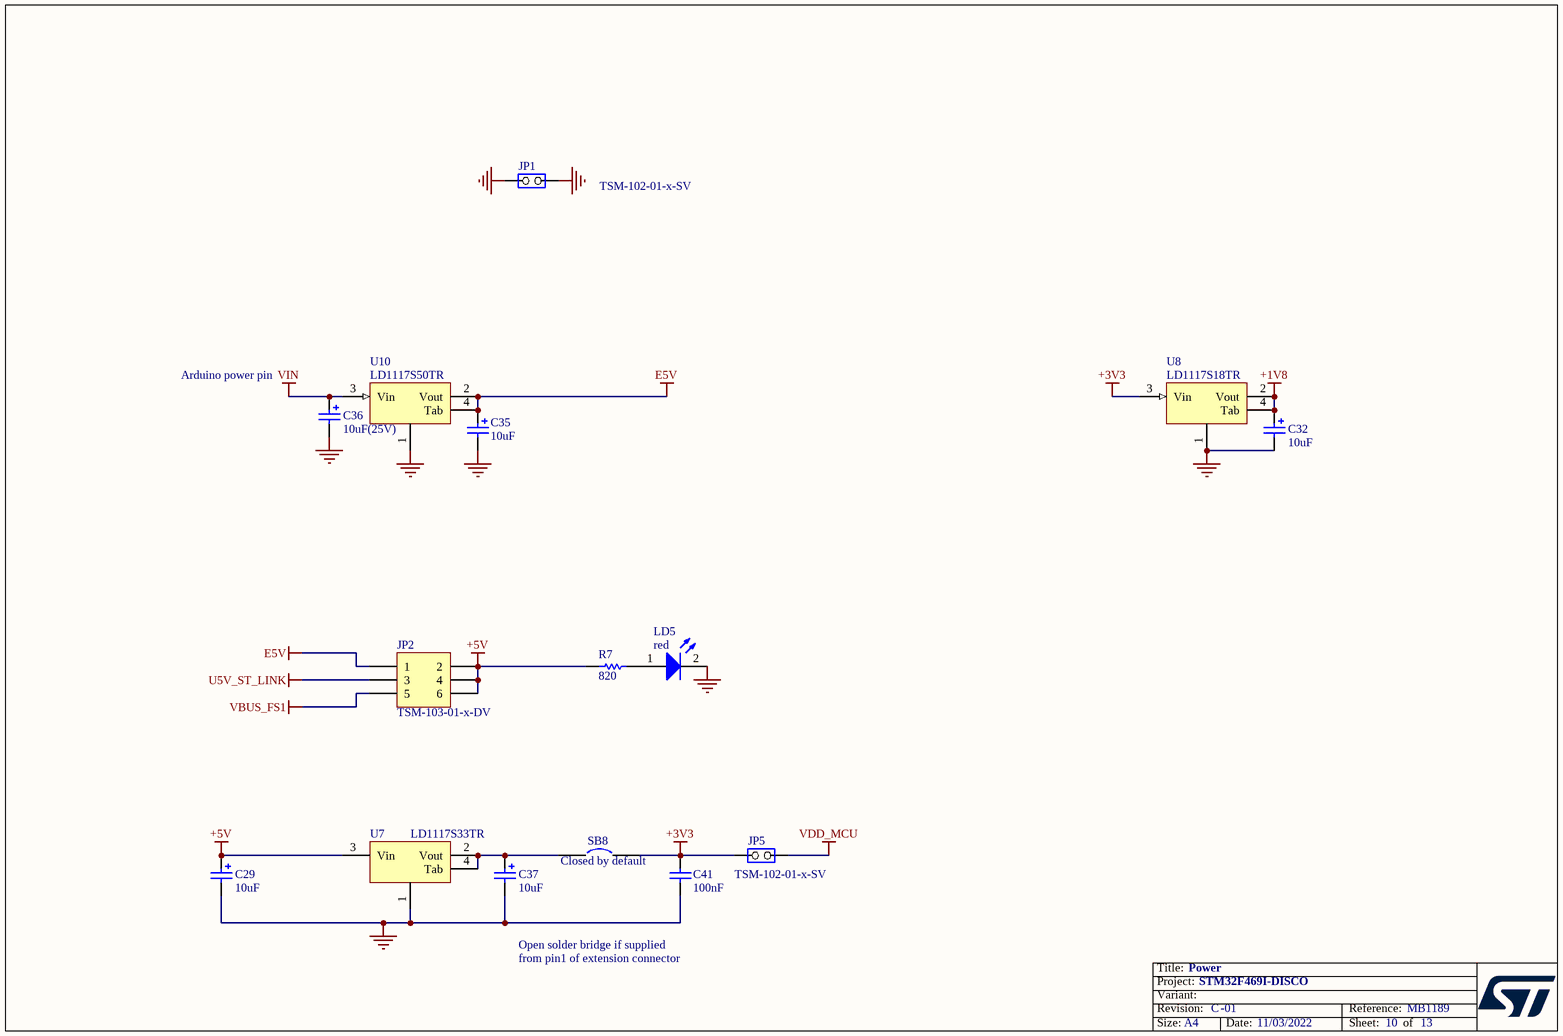
[diagram p4: Power.SchDoc]

### Parts
C29  10uF  [CPOL_TAJ-A_1206_H180]
C32  10uF  [CPOL_TAJ-A_1206_H180]
C35  10uF  [CPOL_TAJ-A_1206_H180]
C36  10uF(25V)  [CPOL_TAJ-B_1210_H210]
C37  10uF  [CPOL_TAJ-A_1206_H180]
C41  100nF  [0402C]
JP1  TSM-102-01-x-SV  [TSM-102-01-x-SV]
JP2  TSM-103-01-x-DV  [TSM-103-01-x-DV]
JP5  TSM-102-01-x-SV  [TSM-102-01-x-SV]
LD5  red  [0603D]
R7  820  [0603R]
SB8  Closed by default  [SB_0603]
U7  LD1117S33TR  [SOT-223]
U8  LD1117S18TR  [SOT-223]
U10  LD1117S50TR  [SOT-223]

### Nets
+1V8: C32.1 U8.2(Vout) U8.4(Tab)
+3V3: C41.1 JP5.1(COMMON) SB8.2 U8.3(Vin)
+5V: C29.1 JP2.2 JP2.4 JP2.6 R7.2 U7.3(Vin)
E5V: C35.1 JP2.1 U10.2(Vout) U10.4(Tab)
GND: C29.2 C32.2 C35.2 C36.2 C37.2 C41.2 JP1.1(COMMON) JP1.2(NO) LD5.2(K) U7.1 U8.1 U10.1
U5V_ST_LINK: JP2.3
VBUS_FS1: JP2.5
VDD_MCU: JP5.2(NO)
VIN: C36.1 U10.3(Vin)
NetC37_1: C37.1 SB8.1 U7.2(Vout) U7.4(Tab)
NetLD5_1: LD5.1(A) R7.1

### Notes on the sheet
- (near C36) Arduino power pin
- Open solder bridge if supplied
  from pin1 of extension connector
- Title:
- Project:
- Size:
- Revision:
- Variant:
- A4
- -
- Date:
- Reference:
- Sheet:
- of

### Library data of the parts
C29 = Cap_TAJA106K016R: Capacitor, Tantalum, 10uF, 16V, 10%, 3Ohms, pkg Type_A (3216 metric), T=1.6mm; Manuf_1: AVX; Value: 10uF (16v); Revision: July-2002: Re-released for DXP Platform.; Manuf_part_1: TAJA106K016R
C32 C35 C37 = Cap_TAJA106K016R: Capacitor, Tantalum, 10uF, 16V, 10%, 3Ohms, pkg Type_A (3216 metric), T=1.6mm; Manuf_1: AVX; Value: 10uF (16V); Revision: July-2002: Re-released for DXP Platform.; Manuf_part_1: TAJA106K016R
C36 = Cap_TAJB106K025RNJ: Capacitor, Tantalum, 10uF, 25V, 10%, 2.5ohms, pkg Type_B (3528 metric), T=1.9mm; Manuf_1: AVX; Revision: July-2002: Re-released for DXP Platform.; Value: 10uF (25V); Manuf_part_1: TAJB106K025RNJ
C41 = Cap: as C42 on sheet Memory; Published: 8-Jun-2000; Revision: July-2002: Re-released for DXP Platform.; Publisher: Altium Limited; Value: 100nF
JP1 = JP2: Manuf_1: SAMTEC; Ordered by: Subcon; Silkscreen: GND; Assembly: with jumper; Manuf_Part_1: TSM-102-01-x-SV
JP2 = Header 3X2: Header, 3-Pin, Dual row; Manuf_1: SAMTEC; Ordered by: Subcon; Silkscreen: E5V:pins1,2 STLK: pins3,4 USB: pins 5,6; Assembly: 3,4 closed; LatestRevisionDate: 17-Jul-2002; LatestRevisionNote: Re-released for DXP Platform.; Publisher: Altium Limited; Manuf_Part_1: TSM-103-01-x-DV
JP5 = JP2: Manuf_1: SAMTEC; Ordered by: Subcon; Assembly: with jumper; Silkscreen: IDD; Manuf_Part_1: TSM-102-01-x-SV
LD5 = LED2: Typical RED, GREEN, YELLOW, AMBER GaAs LED; Manuf_1: Everlight Electronics; Manuf_part_1: 19-217/R6C-AL1M2VY/3T; Ordered by: Subcon; ECCN_US/EU: EAR99/NEC; Silkscreen: 5V; Published: 8-Jun-2000; Revision: July-2002: Re-released for DXP Platform.; Publisher: Altium Limited
R7 = res1: Resistor; Manuf_1: YAGEO; Manuf_part_1: RC0603FR-07820RL; Ordered by: Subcon; Published: 8-Jun-2000; Revision: July-2002: Re-released for DXP Platform.; Publisher: Altium Limited; Value: 820
SB8 = Circuit Breaker: as SB1 on sheet Peripherals; Published: 24-Mar-1999; Revision: July-2002: Re-released for DXP Platform.; Publisher: Altium Limited; ECCN_US/EU: n/a
U7 = LD1117S33TR: LOW DROP FIXED AND ADJUSTABLE POSITIVE VOLTAGE REGULATORS (3.3 Volts); Provided: ST; ECCN_US/EU: EAR99/NEC; Ref St: 9176186; Manuf_1: ST; Manuf_Part_1: LD1117S33TR; Order: LD1117S33TR; Distrib: ST; Ordered by: ST
U8 = LD1117: Ordered by: ST; ECCN_US/EU: EAR99/NEC; Ref St: 9176180; Manuf_1: ST; Manuf_Part_1: LD1117S18TR
U10 = LD1117: Ordered by: ST; ECCN_US/EU: EAR99/NEC; Ref St: 9176133; Manuf_1: ST; Manuf_Part_1: LD1117S50TR

## Sheet ST_LINK_V2-1.SCHDOC: ST-LINK/V2-1
size A4; Date: 9/24/2014; Author: P.A.; CompanyName: STMicroelectronics; Organization: Microcontrollers Division; Address1: 12, Rue Jules HOROWITZ; Address2: 38019 Grenoble; Address3: FRANCE; DocumentNumber: MB1189; Revision: B-07; SheetNumber: 3; SheetTotal: 13; Project: STM32F469I-DISCO
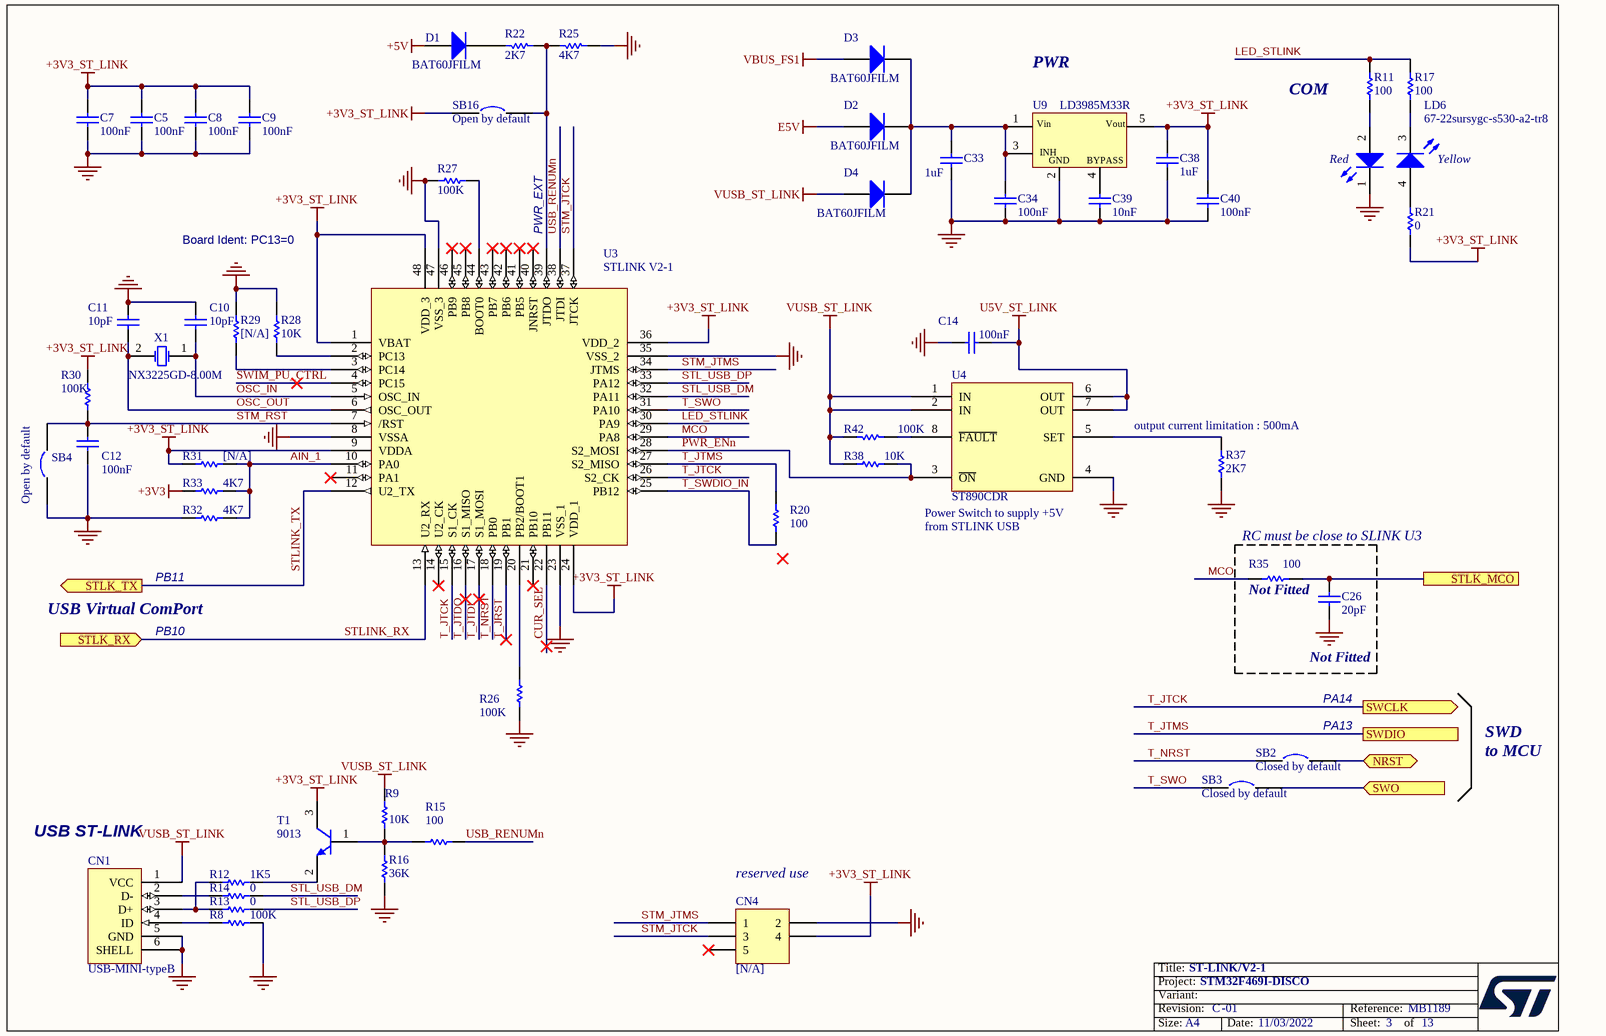
[diagram p5: ST_LINK_V2-1.SCHDOC]

### Parts
C5  100nF  [0402C]
C7  100nF  [0402C]
C8  100nF  [0402C]
C9  100nF  [0402C]
C10  10pF  [0603C]
C11  10pF  [0603C]
C12  100nF  [0402C]
C14  100nF  [0402C]
C26  20pF  [0603C]
C33  1uF  [0603C]
C34  100nF  [0402C]
C38  1uF  [0603C]
C39  10nF  [0603C]
C40  100nF  [0402C]
CN1  USB-MINI-typeB  [MINIUSB_AB_5SM_RA]
CN4  [N/A]  [HDR_2X3-1_2R54-6]
D1  BAT60JFILM  [SOD-323]
D2  BAT60JFILM  [SOD-323]
D3  BAT60JFILM  [SOD-323]
D4  BAT60JFILM  [SOD-323]
LD6  67-22sursygc-s530-a2-tr8  [LED2_3528]
R8  100K  [0603R]
R9  10K  [0402R]
R11  100  [0603R]
R12  1K5  [0603R]
R13  0  [0603R]
R14  0  [0603R]
R15  100  [0603R]
R16  36K  [0603R]
R17  100  [0603R]
R20  100  [0603R]
R21  0  [0603R]
R22  2K7  [0603R]
R25  4K7  [0603R]
R26  100K  [0603R]
R27  100K  [0603R]
R28  10K  [0402R]
R29  [N/A]  [0603R]
R30  100K  [0603R]
R31  [N/A]  [0603R]
R32  4K7  [0603R]
R33  4K7  [0603R]
R35  100  [0603R]
R37  2K7  [0603R]
R38  10K  [0402R]
R42  100K  [0603R]
SB2  Closed by default  [SB_0603]
SB3  Closed by default  [SB_0603]
SB4  Open by default  [SB_0603]
SB16  Open by default  [SB_0603]
T1  9013  [SOT-23]
U3  STLINK V2-1  [LQFP48_0R5_9X9]
U4  ST890CDR  [SOIC8_1R27_4R9X6]
U9  LD3985M33R  [SOT23-5]
X1  NX3225GD-8.00M  [XTAL_2SM_3R2X2R5_H1]

### Ports
NRST (bidir), STLK_MCO, STLK_RX (in), STLK_TX (out), SWCLK (out), SWDIO, SWO (in)

### Nets
+3V3: R33.1
+3V3_ST_LINK: C5.2 C7.2 C8.2 C9.2 C38.1 C40.2 CN4.4 R21.2 R30.2 R31.1 SB16.1 T1.3(C) U3.1(VBAT) U3.9(VDDA) U3.24(VDD_1) U3.36(VDD_2) U3.48(VDD_3) U9.5(Vout)
+5V: D1.1(A)
E5V: D2.1(A)
GND: C5.1 C7.1 C8.1 C9.1 C10.2 C11.2 C12.1 C14.1 C26.2 C33.1 C34.1 C38.2 C39.1 C40.1 CN1.5(GND) CN1.6(SHELL) CN4.2 LD6.1(RED_cathode) R8.2 R16.1 R25.2 R26.1 R27.1 R28.1 R29.1 R32.1 R37.2 SB4.1 U3.8(VSSA) U3.23(VSS_1) U3.35(VSS_2) U3.47(VSS_3) U4.4(GND) U9.2(GND)
U5V_ST_LINK: C14.2 U4.6(OUT) U4.7(OUT)
VBUS_FS1: D3.1(A)
VUSB_ST_LINK: CN1.1(VCC) D4.1(A) R9.2 R38.1 R42.1 U4.1(IN) U4.2(IN)
AIN_1: R31.2 R32.2 R33.2 U3.10(PA0)
CUR_SEL: U3.22(PB11)
LED_STLINK: R11.1 R17.1 U3.30(PA9)
MCO: R35.1 U3.29(PA8)
NRST: SB2.2 ; port NRST
OSC_IN: C10.1 U3.5(OSC_IN) X1.1(OSC1)
OSC_OUT: C11.1 U3.6(OSC_OUT) X1.2(OSC2)
PWR_ENn: R38.2 U3.28(S2_MOSI) U4.3(~{ON})
STL_USB_DM: R14.2 U3.32(PA11)
STL_USB_DP: R13.2 U3.33(PA12)
STLINK_RX: U3.13(U2_RX) ; port STLK_RX  [project net PB10]
STLINK_TX: U3.12(U2_TX) ; port STLK_TX  [project net PB11]
STLK_MCO: C26.1 R35.2 ; port STLK_MCO
STM_JTCK: CN4.3 U3.37(JTCK)
STM_JTMS: CN4.1 U3.34(JTMS)
STM_RST: C12.2 R30.1 SB4.2 U3.7(/RST)
SWIM_PU_CTRL: U3.4(PC15)
SWO: SB3.2 ; port SWO
T_JRST: U3.19(PB1)
T_JTCK: U3.15(S1_CK) U3.26(S2_CK) ; port SWCLK  [project net PA14]
T_JTDI: U3.17(S1_MOSI)
T_JTDO: U3.16(S1_MISO)
T_JTMS: R20.2 U3.27(S2_MISO) ; port SWDIO  [project net PA13]
T_NRST: SB2.1 U3.18(PB0)
T_SWDIO_IN: R20.1 U3.25(PB12)
T_SWO: SB3.1 U3.31(PA10)
USB_RENUMn: R15.2 U3.38(JTDI)
NetC33_2: C33.2 C34.2 D2.2(K) D3.2(K) D4.2(K) U9.1(Vin) U9.3(CE)
NetC39_2: C39.2 U9.4(BYPASS)
NetCN1_2: CN1.2(D-) R14.1
NetCN1_3: CN1.3(D+) R12.1 R13.1
NetCN1_4: CN1.4(ID) R8.1
NetD1_2: D1.2(K) R22.1
NetLD6_2: LD6.2(Red_anode) R11.2
NetLD6_3: LD6.3(YellowGreen_cathode) R17.2
NetLD6_4: LD6.4(YellowGreen_anode) R21.1
NetR9_1: R9.1 R15.1 R16.2 T1.1(B)
NetR12_2: R12.2 T1.2(E)
NetR22_2: R22.2 R25.1 SB16.2 U3.39(JTDO)
NetR26_2: R26.2 U3.20(PB2/BOOT1)
NetR27_2: R27.2 U3.44(BOOT0)
NetR28_2: R28.2 U3.2(PC13)
NetR29_2: R29.2 U3.3(PC14)
NetR37_1: R37.1 U4.5(SET)
NetR42_2: R42.2 U4.8(~{FAULT})

Not connected (* = marked no-connect by the designer): CN4 5*; U3 11(PA1)* 14(U2_CK)* 21(PB10)* 40(JNRST)* 41(PB5)* 42(PB6)* 43(PB7)* 45(PB8)* 46(PB9)*

### Notes on the sheet
- PWR
- COM
- Board Ident: PC13=0
- PWR_EXT
- (near R37) output current limitation : 500mA
- PB11
- (near U4) Power Switch to supply +5V from STLINK USB
- RC must be close to SLINK U3
- USB Virtual ComPort
- PB10
- Not Fitted
- (near C26) Not Fitted
- PA14
- (near SB2) PA13
- SWD
  to MCU
- (near CN1) USB ST-LINK
- (near CN4) reserved use
- Title:
- Project:
- Size:
- Revision:
- Variant:
- A4
- -
- Date:
- Reference:
- Sheet:
- of
- (in symbol HSMF-A201-A00J1) Red; Yellow
- (in symbol LD3985M33R) INH

### Library data of the parts
C5 C7-C9 C12 C14 C34 C40 = Capacitor_ST: Capacitor 0402 / 0603 / 0805; Manuf_part_1: CC0402KRX7R7BB104; Manuf_1: YAGEO; Ordered by: Subcon; Revision: July-2002: Re-released for DXP Platform.; Value: 100nF
C10 = Capacitor_ST: Capacitor 0402 / 0603 / 0805; Manuf_1: YAGEO; Manuf_part_1: CC0603JRNPO9BN100; Ordered by: Subcon; Revision: July-2002: Re-released for DXP Platform.; Value: 10pF
C11 = Capacitor_ST: Capacitor 0402 / 0603 / 0805; Manuf_part_1: CC0603JRNPO9BN100; Manuf_1: YAGEO; Ordered by: Subcon; Revision: July-2002: Re-released for DXP Platform.; Value: 10pF
C26 = Cap_20pF_NPO_5%_0402: Capacitor,20pF,50V,NPO,5%,0402,YAGEO; Order: CC0402JRNPO9BN200; Fitted: NO; Ordered by: Subcon; Revision: July-2002: Re-released for DXP Platform.; Value: 20pF; Manuf_1: YAGEO; Manuf_Part_1: CC0402JRNPO9BN200
C33 C38 = CAP SMD 0603  X5R 1µF 25V 10%: Capacitor; Manuf_1: YAGEO; Manuf_part_1: CC0603KRX5R7BB105; Rated voltage: 25V; Tolerance: 10%; Ordered by: Subcon; Order code Farnell: 1288202RL; Value: 1uF; Power: *; Technology: X5R; Temperature  Factor: *; Temperature Max: +125°C; Temperature Min: -55°C; STS Code: *
C39 = CAP SMD 0603  X7R 10000PF 50V 10%: 0603  X7R 10NF; Manuf_1: YAGEO; Manuf_part_1: CC0603KRX7R9BB103; Order code RS: 2040779; Rated voltage: 50V; Tolerance: 10%; Ordered by: Subcon; Order code Farnell: 7569548RL; Value: 10NF; Power: *; Technology: X7R; Temperature Factor: *; Temperature Min: -55°C; Temperature Max: +125°C; STS Code: *
CN1 = USB-MINI-typeB connector: Manuf_Part_1: 5075BMR-05-SM; Manuf_1: NELTRON; Ordered by: Subcon; Silkscreen: USB ST-LINK; Order: 5075BMR-05-SM
CN4 = Header 3X2: Header, 3-Pin, Dual row; Fitted: NO; Ordered by: Subcon; Revision: 17-Jul-2002: Re-released for DXP Platform.; Publisher: Altium Limited
D1-D4 = BAT60JFILM: Provided: ST; ECCN_US/EU: EAR99/NEC; Ref St: 9151097; Revision: July-2002: Re-released for DXP Platform.; Order: BAT60JFILM; Manuf_Part_1: BAT60JFILM; Manuf_1: ST; Distrib: ST; Ordered by: ST
LD6 = HSMF-A201-A00J1: Manuf_1: EVERLIGHT; Ordered by: Subcon; Manuf_part_1: 67-22sursygc-s530-a2-tr8
R8 = res1: as R6 on sheet Peripherals; Published: 8-Jun-2000; Revision: July-2002: Re-released for DXP Platform.; Publisher: Altium Limited; Value: 100K
R9 = Res1: Resistor; Manuf_1: YAGEO; Manuf_part_1: RC0402FR-0710KL; Ordered by: Subcon; Published: 8-Jun-2000; Revision: July-2002: Re-released for DXP Platform.; Publisher: Altium Limited; Value: 10K
R11 R17 = Res1: as R10 on sheet Peripherals; Published: 8-Jun-2000; Revision: July-2002: Re-released for DXP Platform.; Publisher: Altium Limited; Value: 100
R12 = Resistor_ST: Resistor; Manuf_1: YAGEO; MAnuf_part_1: RC0603FR-071K5L; Ordered by: Subcon; Value: 1K5
R13 R14 = Resistor_ST: Resistor; Manuf_1: YAGEO; Manuf_part_1: RC0603JR-070RL; Ordered by: Subcon; Value: 0
R15 R35 = Resistor_ST: Resistor 0402 / 0603 / 0805; Manuf_1: YAGEO; Manuf_part_1: RC0603FR-07100RL; Ordered by: Subcon; Value: 100
R16 = Res1: Resistor; Manuf_1: YAGEO; Manuf_part_1: RC0603FR-0736KL; Ordered by: Subcon; Published: 8-Jun-2000; Revision: July-2002: Re-released for DXP Platform.; Publisher: Altium Limited; Value: 36K
R20 = Resistor_ST: Resistor; Manuf_1: YAGEO; Manuf_part_1: RC0603FR-07100RL; Ordered by: Subcon; Value: 100
R21 = Res1: as R57 on sheet Peripherals; Published: 8-Jun-2000; Revision: July-2002: Re-released for DXP Platform.; Publisher: Altium Limited; Value: 0
R22 = Res1: Resistor; Manuf_1: YAGEO; Manuf_part_1: RC0603FR-072K7L; Ordered by: Subcon; Published: 8-Jun-2000; Revision: July-2002: Re-released for DXP Platform.; Publisher: Altium Limited; Value: 2K7
R25 = Res1: Resistor; Manuf_1: YAGEO; Manuf_part_1: RC0603FR-074K7L; Ordered by: Subcon; Published: 8-Jun-2000; Revision: July-2002: Re-released for DXP Platform.; Publisher: Altium Limited; Value: 4K7
R26 R27 R30 = Resistor_ST: Resistor 0402 / 0603 / 0805; Manuf_1: YAGEO; Manuf_part_1: RC0603FR-07100KL; Ordered by: Subcon; Value: 100K
R28 R38 = Resistor_ST: Resistor; Manuf_1: YAGEO; Manuf_part_1: RC0402FR-0710KL; Ordered by: Subcon; Value: 10K
R29 R31 = Resistor_ST: Resistor 0402 / 0603 / 0805; Value: 10K; Fitted: NO; Ordered by: Subcon
R32 R33 = Resistor_ST: Resistor 0402 / 0603 / 0805; Manuf_1: YAGEO; Manuf_part_1: RC0603FR-074K7L; Ordered by: Subcon; Value: 4K7
R37 = Resistor_ST: Resistor 0402 / 0603 / 0805; Manuf_1: YAGEO; Manuf_part_1: RC0603FR-072K7L; Ordered by: Subcon; Value: 2K7
R42 = Res1: Resistor; Manuf_1: YAGEO; Manuf_part_1: RC0603FR-07100KL; Ordered by: Subcon; Published: 8-Jun-2000; Revision: July-2002: Re-released for DXP Platform.; Publisher: Altium Limited; Value: 100K
SB2 SB3 = Circuit Breaker: as SB1 on sheet Peripherals; Published: 24-Mar-1999; Revision: July-2002: Re-released for DXP Platform.; Publisher: Altium Limited
SB4 SB16 = Circuit Breaker: Ordered by: Subcon; Comments: Solder bridge; Solder: NO; Published: 24-Mar-1999; Revision: July-2002: Re-released for DXP Platform.; Publisher: Altium Limited
T1 = NPN: NPN Bipolar Transistor; Manuf_Part_1: MMBT9013; Code - JEDEC: TO-226-AA; Ordered by: Subcon; ECCN_US/EU: EAR99/NEC; Published: 8-Jun-2000; Revision: July-2002: Re-released for DXP Platform.; Publisher: Altium Limited
U3 = STM32F10x(48pin): Manuf_Part_1: STM32F103CBT6; Ordered by: ST; ECCN_US/EU: 3A991A2/NEC; Ref St: 9175111; Distrib: ST; Manuf_1: ST
U4 = ST890CDR: Ordered by: ST; Ref St: 9172002; ECCN_US/EU: EAR99/NEC; Manuf_1: ST; Manuf_Part_1: ST890CDR
U9 = LD3985M33R: Ultra low drop-low noise BiCMOS voltage, regulators low ESR capacitors compatible; Manuf_1: ST; Ref St: 9176161; ECCN_US/EU: EAR99/NEC; Manuf_Part_1: LD3985M33R; Provided: ST; Distrib: ST; Order: LD3985M33R; Ordered by: ST
X1 = XTAL_8M_NX3225GD: Crystal 8Mhz, 8pF, -+50PPM, SMD; Manuf_1: NDK; Manuf_Part_1: NX3225GD 8MHz EXS00A-CG04874; Manuf_Part_2: NX3225GD-8.000M-STD-CRA-3; ECCN_US/EU: EAR99/NEC; NDK Ref: X3127326; Ref St: 9157029; Provided: ST; Order: NX3225GD 8MHz EXS00A-CG04874; Ordered by: ST